# Altium project Dummy.PrjPcb
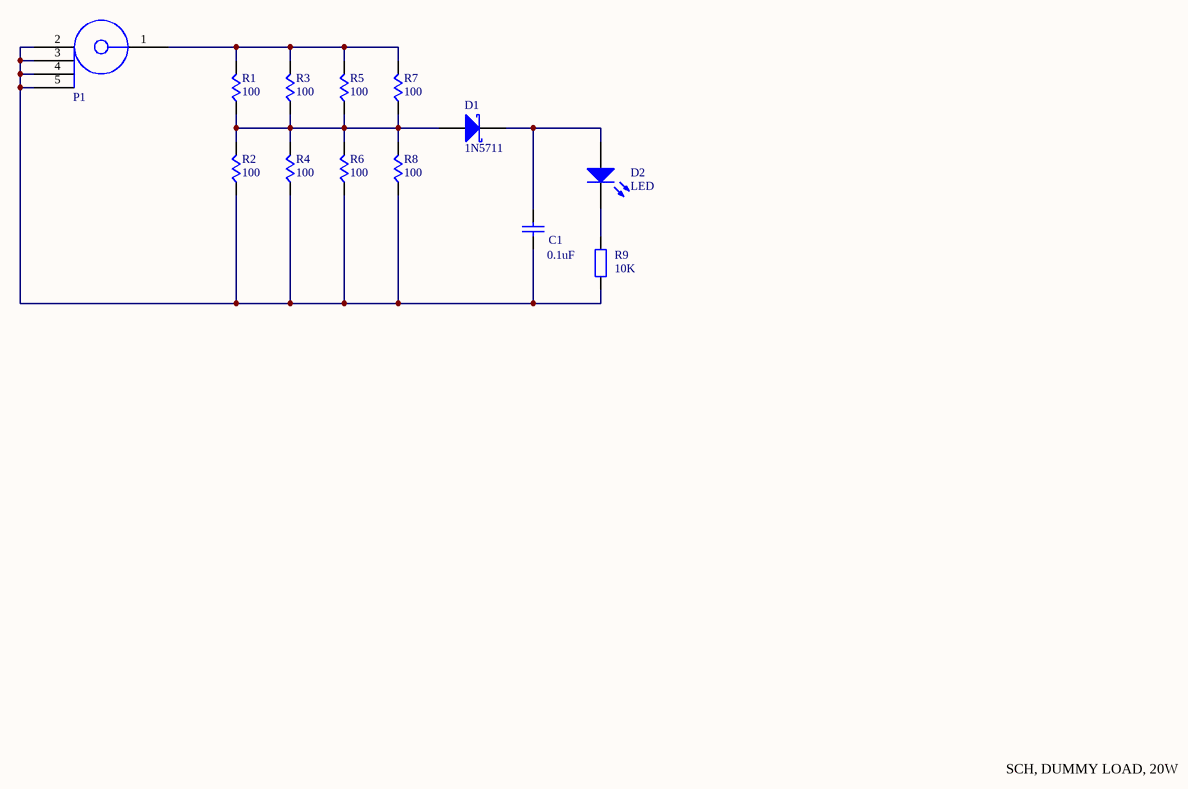
[diagram p0: DummyLoad_SCH.SchDoc]
1 sheet, 13 parts. Net scope: global (net labels, ports and power ports of the same name join across sheets).
Board file: DummyLoad_Rev1.PcbDoc

## Sheet DummyLoad_SCH.SchDoc
size B

### Parts
C1  value 0.1uF  [CAP_AR20]  (hidden comment: CAP)
D1  value 1N5711  [STM-DO-35-2]  (hidden comment: Diode)
D2  LED  [Type 5mm]
P1  CONN_BNC  [CONN_5-1634513-1]  (value not drawn)
R1  value 100  [Axial 0.8]  (hidden comment: R)
R2  value 100  [Axial 0.8]  (hidden comment: R)
R3  value 100  [Axial 0.8]  (hidden comment: R)
R4  value 100  [Axial 0.8]  (hidden comment: R)
R5  value 100  [Axial 0.8]  (hidden comment: R)
R6  value 100  [Axial 0.8]  (hidden comment: R)
R7  value 100  [Axial 0.8]  (hidden comment: R)
R8  value 100  [Axial 0.8]  (hidden comment: R)
R9  value 10K  [AXIAL-0.4]

### Nets
NetC1_1: C1.1 P1.2 P1.3 P1.4 P1.5 R2.1 R4.1 R6.1 R8.1 R9.1
NetC1_2: C1.2 D1.2(K) D2.2(A)
NetD1_1: D1.1(A) R1.1 R2.2 R3.1 R4.2 R5.1 R6.2 R7.1 R8.2
NetD2_1: D2.1(K) R9.2
NetP1_1: P1.1 R1.2 R3.2 R5.2 R7.2

### Notes on the sheet
- SCH, DUMMY LOAD, 20W

### Library data of the parts
C1 = CAP: Manufacturer 1: Kyocera AVX; Manufacturer Part Number 1: SR205E104MAR; Tolerance: 20%; Capacitance: 100nF; Dielectric: Z5U; Voltage Rating (DC): 50V; Lead/Base Style: Straight; Temperature Coefficient: 30ppm/°C; Lead Diameter: 0.508mm; Lead Length: 1mm; Supplier 1: Digi-Key; Supplier Part Number 1: 478-3192-ND; Mount: Through Hole; Case/Package: Dipped; Number of Pins: 2; Min Operating Temperature: 10°C; Max Operating Temperature: 85°C; Termination: Radial; Voltage Rating: 50V; Package Quantity: 1000; Packaging: Bulk; Voltage: 50V; Length: 5.08mm; Height: 5.08mm; Lead Pitch: 2.54mm; Width: 3.175mm; Depth: 3.175mm; Thickness: 3.17mm; Height - Seated (Max): 0.2inch; Radiation Hardening: No; Lead Free: Lead Free; REACH SVHC: No SVHC; ComponentLink1URL: https://datasheet.ciiva.com/34301/767682-34301506.pdf?src-supplier=Jameco; ComponentLink1Description: https://datasheet.ciiva.com/34301/767682-34301506.pdf?src-supplier=Jameco; ComponentLink2URL: https://datasheet.ciiva.com/11786/0900766b8064818e-11786605.pdf?src-supplier=RSComponents; ComponentLink2Description: https://datasheet.ciiva.com/11786/0900766b8064818e-11786605.pdf?src-supplier=RSComponents; ComponentLink3URL: https://datasheet.ciiva.com/2990/skycap-sr-2990033.pdf?src-supplier=Avnet; ComponentLink3Description: https://datasheet.ciiva.com/2990/skycap-sr-2990033.pdf?src-supplier=Avnet; ComponentLink4URL: https://datasheet.ciiva.com/154/skycap-154474.pdf?src-supplier=Digi-Key; ComponentLink4Description: https://datasheet.ciiva.com/154/skycap-154474.pdf?src-supplier=Digi-Key; ComponentLink5URL: https://datasheet.ciiva.com/7916/1897122-7916327.pdf?src-supplier=Element14; ComponentLink5Description: https://datasheet.ciiva.com/7916/1897122-7916327.pdf?src-supplier=Element14; ComponentLink6URL: https://datasheet.ciiva.com/14585/70195658-14585210.pdf?src-supplier=Allied+Electronics; ComponentLink6Description: https://datasheet.ciiva.com/14585/70195658-14585210.pdf?src-supplier=Allied+Electronics; ComponentLink7URL: https://datasheet.ciiva.com/16204/skycap-sr-16204908.pdf?src-supplier=Future+Electronics; ComponentLink7Description: https://datasheet.ciiva.com/16204/skycap-sr-16204908.pdf?src-supplier=Future+Electronics
D1 = Diode: Small Signal Schottky Diode, 70 V, -65 to 200 degC, 2-Pin THD (DO-35), RoHs, Tape and Reel; Manufacturer: STMicroelectronics; Diode Configuration: Single; Repetitive Reverse Voltage Vrrm Max: 70V; Forward Current If(AV): 15mA; No. of Pins: 2Pins; Diode Case Style: DO-204AH; SVHC: NoSVHC(17-Dec-2015); Product Range: 1N5711Series; Forward Voltage VF Max: 410mV; Forward Voltage: 1V; Max Power Dissipation: 430mW; Polarity: Standard; Peak Reverse Current: 200nA; Reverse Recovery Time: 100ps; Outside Diameter: 1.93mm; Manufacturer URL: http://www.st.com/; Automotive Qualification Standard: -; Datasheet URL: http://www.st.com/content/ccc/resource/technical/document/datasheet/a8/9d/10/57/ac/a3/4f/81/CD00000759.pdf/files/CD00000759.pdf/jcr:content/translations/en.CD00000759.pdf; Datasheet Version: 10/2001; Package Description: 2-Pin Axial Lead, Dia 1.765 mm, Body Length 3.775 mm; Forward Surge Current Ifsm Max: -; Mounting Technology: ThroughHole; Operating Temperature Max: 200°C; Package Reference: DO-35-2; Packaging: Tape&Reel; Supplier 1: Digi-Key; Supplier Part Number 1: 497-2499-1-ND; Manufacturer 1: STMicroelectronics; Manufacturer Part Number 1: 1N5711; Mount: Through Hole; Number of Pins: 2; Weight: 0.01lb; Contact Plating: Tin; Min Operating Temperature: -65°C; Max Operating Temperature: 200°C; Element Configuration: Single; Max Repetitive Reverse Voltage (Vrrm): 70V; Forward Current: 15mA; Package Quantity: 1; Max Current Rating: 15mA; Voltage Rating (DC): 70V; Current Rating: 15mA; Output Current: 15mA; Max Reverse Leakage Current: 200nA; Termination: Axial; Power Dissipation: 430mW; Reverse Voltage (DC): 70V; Breakdown Voltage: 70V; Diameter: 2mm; Length: 4.5mm; Height: 2mm; Width: 2mm; Radiation Hardening: No; Lead Free: Lead Free; REACH SVHC: No SVHC; ComponentLink1URL: https://datasheet.ciiva.com/15144/getdatasheetpartid-82812-15144534.pdf?src-supplier=Verical; ComponentLink1Description: https://datasheet.ciiva.com/15144/getdatasheetpartid-82812-15144534.pdf?src-supplier=Verical; ComponentLink2URL: https://datasheet.ciiva.com/4714/cd00000759-106159-4714153.pdf?src-supplier=Mouser; ComponentLink2Description: https://datasheet.ciiva.com/4714/cd00000759-106159-4714153.pdf?src-supplier=Mouser; ComponentLink3URL: https://datasheet.ciiva.com/1178/1693751-1178459.pdf?src-supplier=Element14; ComponentLink3Description: https://datasheet.ciiva.com/1178/1693751-1178459.pdf?src-supplier=Element14; ComponentLink4URL: https://datasheet.ciiva.com/1178/1470783-1178460.pdf?src-supplier=Element14; ComponentLink4Description: https://datasheet.ciiva.com/1178/1470783-1178460.pdf?src-supplier=Element14; ComponentLink5URL: https://datasheet.ciiva.com/26338/155459-da-01-en-diode-1n5711-stm-26338799.pdf?src-supplier=Conrad; ComponentLink5Description: https://datasheet.ciiva.com/26338/155459-da-01-en-diode-1n5711-stm-26338799.pdf?src-supplier=Conrad; ComponentLink6URL: https://datasheet.ciiva.com/14557/70013815-14557671.pdf?src-supplier=Allied+Electronics; ComponentLink6Description: https://datasheet.ciiva.com/14557/70013815-14557671.pdf?src-supplier=Allied+Electronics; ComponentLink7URL: https://datasheet.ciiva.com/6365/cd00000759-6365917.pdf?src-supplier=Digi-Key; ComponentLink7Description: https://datasheet.ciiva.com/6365/cd00000759-6365917.pdf?src-supplier=Digi-Key; ComponentLink8URL: https://datasheet.ciiva.com/6365/cd00000759-6365918.pdf?src-supplier=Digi-Key; ComponentLink8Description: https://datasheet.ciiva.com/6365/cd00000759-6365918.pdf?src-supplier=Digi-Key
D2 = LED: THT LED round mono-color color lens, WL-TMRW, Red; PartNumber: 151051RS11000; Manufacturer: Wuerth Elektronik; Manufacturer 1: Wurth Electronics; Luminous Intensity: 30mcd; Forward Voltage: 2.1V; Viewing Angle: 60°; Lens Style: Diffused; Wavelength: 630nm; Dominant Wavelength: 645nm; Test Current: 20mA; Forward Current: 30mA; Lens Size: 5mm; PackageReference: Type 5mm; ComponentLink2URL: http://katalog.we-online.de/pbs/datasheet/7448042001.pdfhttp://katalog.we-online.de/pbs/datasheet/7448042001.pdfhttp://katalog.we-online.de/pbs/datasheet/7448042001.pdfhttp://katalog.we-online.de/pbs/datasheet/151051RS11000.pdf; ComponentLink1URL: http://www.we-online.com; ComponentLink1Description: Manufacturer URL; ComponentLink2Description: Datasheet; Emitting color: Red; Value: LED; Supplier 1: Digi-Key; Supplier Part Number 1: 732-5016-ND; Manufacturer Part Number 1: 151051RS11000; Mount: Through Hole; Case/Package: Radial; Color: Red; Min Operating Temperature: -40°C; Max Operating Temperature: 85°C; Package Quantity: 1; Height: 8.9mm; REACH SVHC: Unknown; ComponentLink3URL: https://datasheet.ciiva.com/23843/151051rs11000-23843281.pdf?src-supplier=Newark; ComponentLink3Description: https://datasheet.ciiva.com/23843/151051rs11000-23843281.pdf?src-supplier=Newark; ComponentLink4URL: https://datasheet.ciiva.com/29335/759488-da-01-en-tht-led-5mm-rot-151051rs11000-29335455.pdf?src-supplier=Conrad; ComponentLink4Description: https://datasheet.ciiva.com/29335/759488-da-01-en-tht-led-5mm-rot-151051rs11000-29335455.pdf?src-supplier=Conrad; ComponentLink5URL: https://datasheet.ciiva.com/22657/1911506-22657034.pdf?src-supplier=Element14; ComponentLink5Description: https://datasheet.ciiva.com/22657/1911506-22657034.pdf?src-supplier=Element14; ComponentLink6URL: https://datasheet.ciiva.com/29562/151051rs11000-29562906.pdf?src-supplier=Digi-Key; ComponentLink6Description: https://datasheet.ciiva.com/29562/151051rs11000-29562906.pdf?src-supplier=Digi-Key
R1-R8 = R: Resistor; Manufacturer 1: Panasonic; Manufacturer Part Number 1: ERG-3SJ101V; Resistance: 100R; Tolerance: 5%; Power Rating: 3W; Temperature Coefficient: 300ppm/°C; Voltage Rating: 700V; Lead Diameter: 0.8mm; Supplier 1: Digi-Key; Supplier Part Number 1: P100W-3CT-ND; Mount: Through Hole; Case/Package: Conformal; Contact Plating: Tin; Min Operating Temperature: -55°C; Max Operating Temperature: 200°C; Composition: Metal Oxide; Package Quantity: 1000; Packaging: Ammo Pack; Termination: Axial; Number of Terminations: 2; Military Standard: Not; Max Power Dissipation: 3W; Diameter: 5.5mm; Length: 15mm; Radiation Hardening: No; ComponentLink1URL: https://datasheet.ciiva.com/26914/getdatasheetpartid-170686-26914097.pdf?src-supplier=Verical; ComponentLink1Description: https://datasheet.ciiva.com/26914/getdatasheetpartid-170686-26914097.pdf?src-supplier=Verical
R9 = Res2: Resistor; Manufacturer 1: Yageo; Manufacturer Part Number 1: CFR-25JB-52-10K; Resistance: 10kR; Tolerance: 5%; Temperature Coefficient: 500ppm/°C; Max Power Dissipation: 250mW; Published: 8-Jun-2000; LatestRevisionDate: 17-Jul-2002; LatestRevisionNote: Re-released for DXP Platform.; PackageReference: AXIAL-0.4; Publisher: Altium Limited; PackageDescription: Axial Device, Thru-Hole; 2 Leads; 0.4 in Pin Spacing; Supplier 1: Digi-Key; Supplier Part Number 1: 10KQBK-ND; Case/Package: Axial; Min Operating Temperature: -55°C; Max Operating Temperature: 155°C; Package Quantity: 200; Packaging: Bulk; Composition: Carbon Film; Number of Terminations: 2; Length: 0.248inch; Lead Free: Lead Free; ComponentLink1URL: http://components.arrow.com/part/dataview/0323_07021247?src-supplier=Arrow+Europe; ComponentLink1Description: http://components.arrow.com/part/dataview/0323_07021247?src-supplier=Arrow+Europe; ComponentLink2URL: http://www.yageo.com/NewPortal/yageodocoutput?fileName=/pdf/throughhole/Yageo_LR_CFR_2013.pdf&src-supplier=Digi-Key; ComponentLink2Description: http://www.yageo.com/NewPortal/yageodocoutput?fileName=/pdf/throughhole/Yageo_LR_CFR_2013.pdf&src-supplier=Digi-Key